# EAGLE design BL (EAGLE 6.6.0)
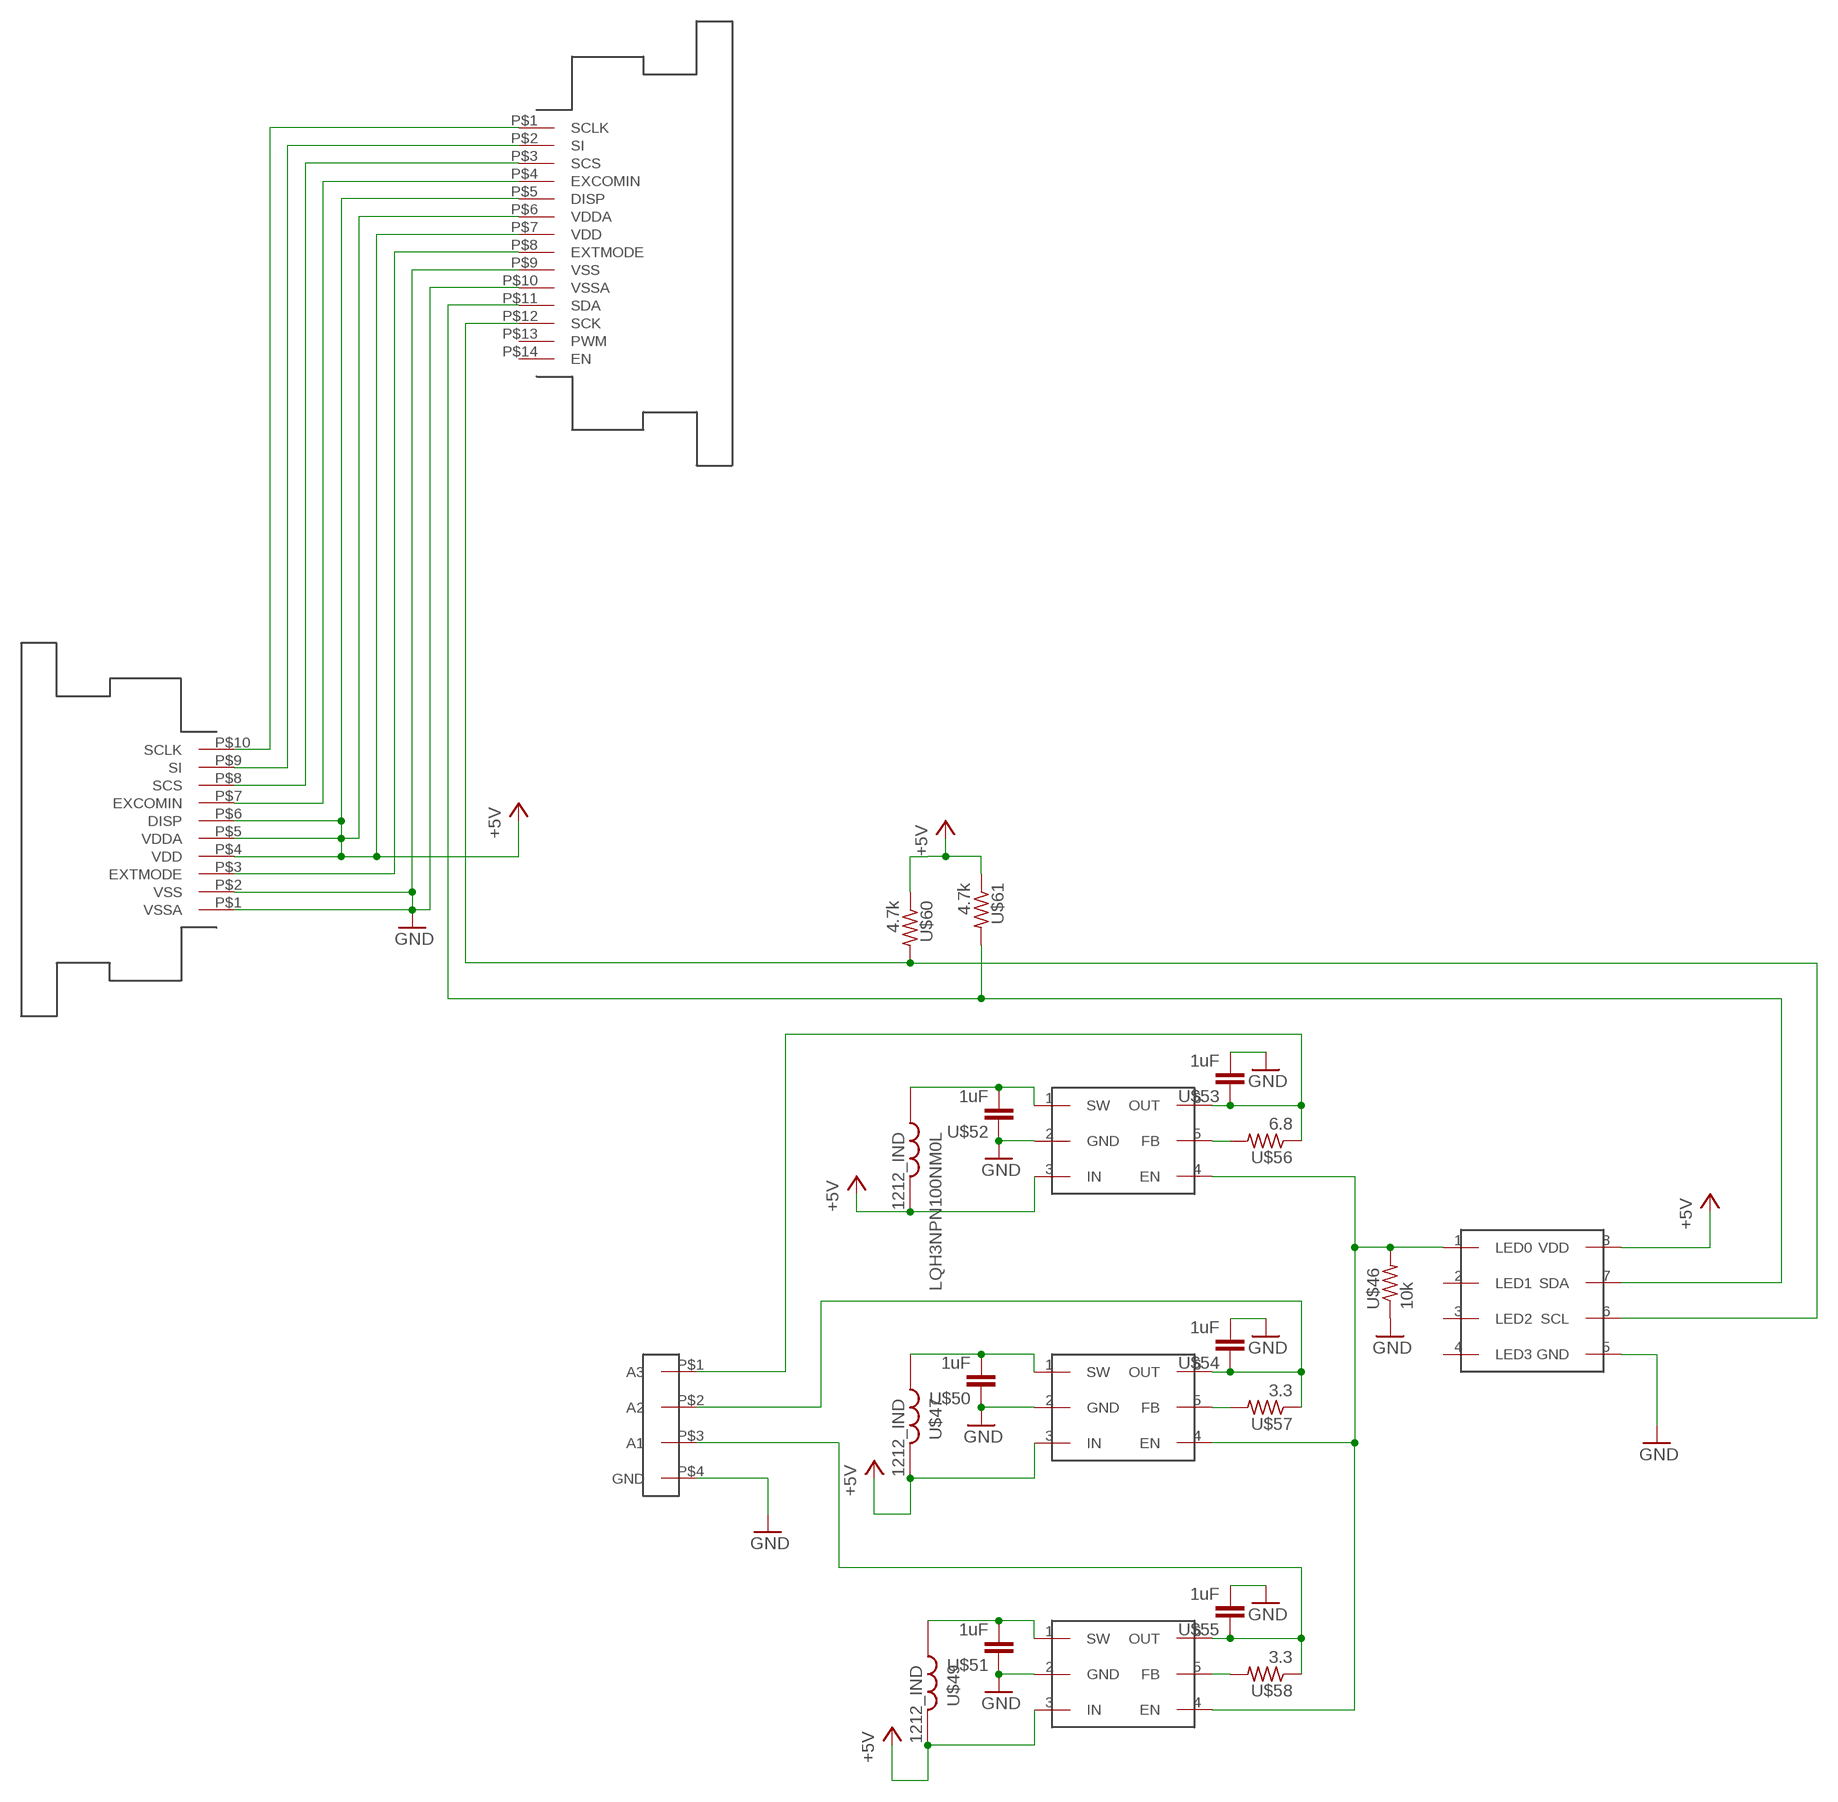
[diagram p0: schematic, sheet 1]

## Parts
LQH3NPN100NM0L  1212_IND  [1212_IND]
U$1  52745-1097  [52745-1097]
U$2  SFV14R-2STE1HLF  [SFV14R-2STE1HLF]
U$36  SC4541  [SOT23-6]
U$37  SC4541  [SOT23-6]
U$44  SC4541  [SOT23-6]
U$45  PCA9632DP1  [TSSOP-8]
U$46  10k  RF-R0805  [RF-C0805]
U$47  1212_IND  [1212_IND]
U$49  1212_IND  [1212_IND]
U$50  1uF  RF-C0805  [C0805]
U$51  1uF  RF-C0805  [C0805]
U$52  1uF  RF-C0805  [C0805]
U$53  1uF  RF-C0805  [C0805]
U$54  1uF  RF-C0805  [C0805]
U$55  1uF  RF-C0805  [C0805]
U$56  6.8  RF-R0805  [RF-C0805]
U$57  3.3  RF-R0805  [RF-C0805]
U$58  3.3  RF-R0805  [RF-C0805]
U$59  BL_CONSOLDER  [S9091-46R]
U$60  4.7k  RF-R0805  [RF-C0805]
U$61  4.7k  RF-R0805  [RF-C0805]

## Nets
+5V: LQH3NPN100NM0L.P$1 U$1.P$4(VDD) U$1.P$5(VDDA) U$1.P$6(DISP) U$2.P$5(DISP) U$2.P$6(VDDA) U$2.P$7(VDD) U$36.3(IN) U$37.3(IN) U$44.3(IN) U$45.8(VDD) U$47.P$1 U$49.P$1 U$60.1 U$61.1
GND [GND]: U$1.P$1(VSSA) U$1.P$2(VSS) U$2.P$9(VSS) U$2.P$10(VSSA) U$36.2(GND) U$37.2(GND) U$44.2(GND) U$45.5(GND) U$46.1 U$50.1 U$51.1 U$52.1 U$53.2 U$54.2 U$55.2 U$59.P$4(GND)
N$1: U$1.P$10(SCLK) U$2.P$1(SCLK)
N$2: U$1.P$9(SI) U$2.P$2(SI)
N$3: U$1.P$8(SCS) U$2.P$3(SCS)
N$4: U$1.P$7(EXCOMIN) U$2.P$4(EXCOMIN)
N$8: U$1.P$3(EXTMODE) U$2.P$8(EXTMODE)
N$43: U$36.4(EN) U$37.4(EN) U$44.4(EN) U$45.1(LED0) U$46.2
N$44: U$37.1(SW) U$47.P$2 U$50.2
N$45: U$2.P$11(SDA) U$45.7(SDA) U$61.2
N$46: LQH3NPN100NM0L.P$2 U$36.1(SW) U$52.2
N$47: U$2.P$12(SCK) U$45.6(SCL) U$60.2
N$48: U$44.1(SW) U$49.P$2 U$51.2
N$50: U$44.5(FB) U$58.2
N$51: U$44.6(OUT) U$55.1 U$58.1 U$59.P$3(A1)
N$52: U$37.5(FB) U$57.2
N$53: U$37.6(OUT) U$54.1 U$57.1 U$59.P$2(A2)
N$54: U$36.6(OUT) U$53.1 U$56.1 U$59.P$1(A3)
N$55: U$36.5(FB) U$56.2
Unconnected: U$2.P$13(PWM) U$2.P$14(EN) U$45.2(LED1) U$45.3(LED2) U$45.4(LED3)

## Library data of the parts
LQH3NPN100NM0L U$47 U$49 = KW2:1212_IND; MFGN: Murata; MFGP: LQH3NPN100NM0L
U$1 = KW2:52745-1097
U$2 = KW2:SFV14R-2STE1HLF
U$36 U$37 U$44 = KW2:SC4541; MFGN: Semtech; MFGP: SC4541
U$45 = KW2:PCA9632DP1; MFGN: NXP; MFGP: PCA9632DP1
U$46 = GW-devices:RF-R: RF resistor pads for FSL reference design; MFGN: Vishay Dale; MFGP: CRCW080510K0FKEA
U$50-U$55 = GW-devices:RF-C: RF capacitor pads for FSL reference design; MFGN: TDK; MFGP: C2012X5R1E105K125AA
U$56 = GW-devices:RF-R: RF resistor pads for FSL reference design; MFGN: Yageo; MFGP: RC0805FR-076R8L
U$57 U$58 = GW-devices:RF-R: RF resistor pads for FSL reference design; MFGN: Samsung; MFGP: RC2012F3R3CS
U$59 = KW2:BL_CON
U$60 U$61 = GW-devices:RF-R: RF resistor pads for FSL reference design; MFGN: Panasonic; MFGP: ERJ-6ENF4701V

## Board
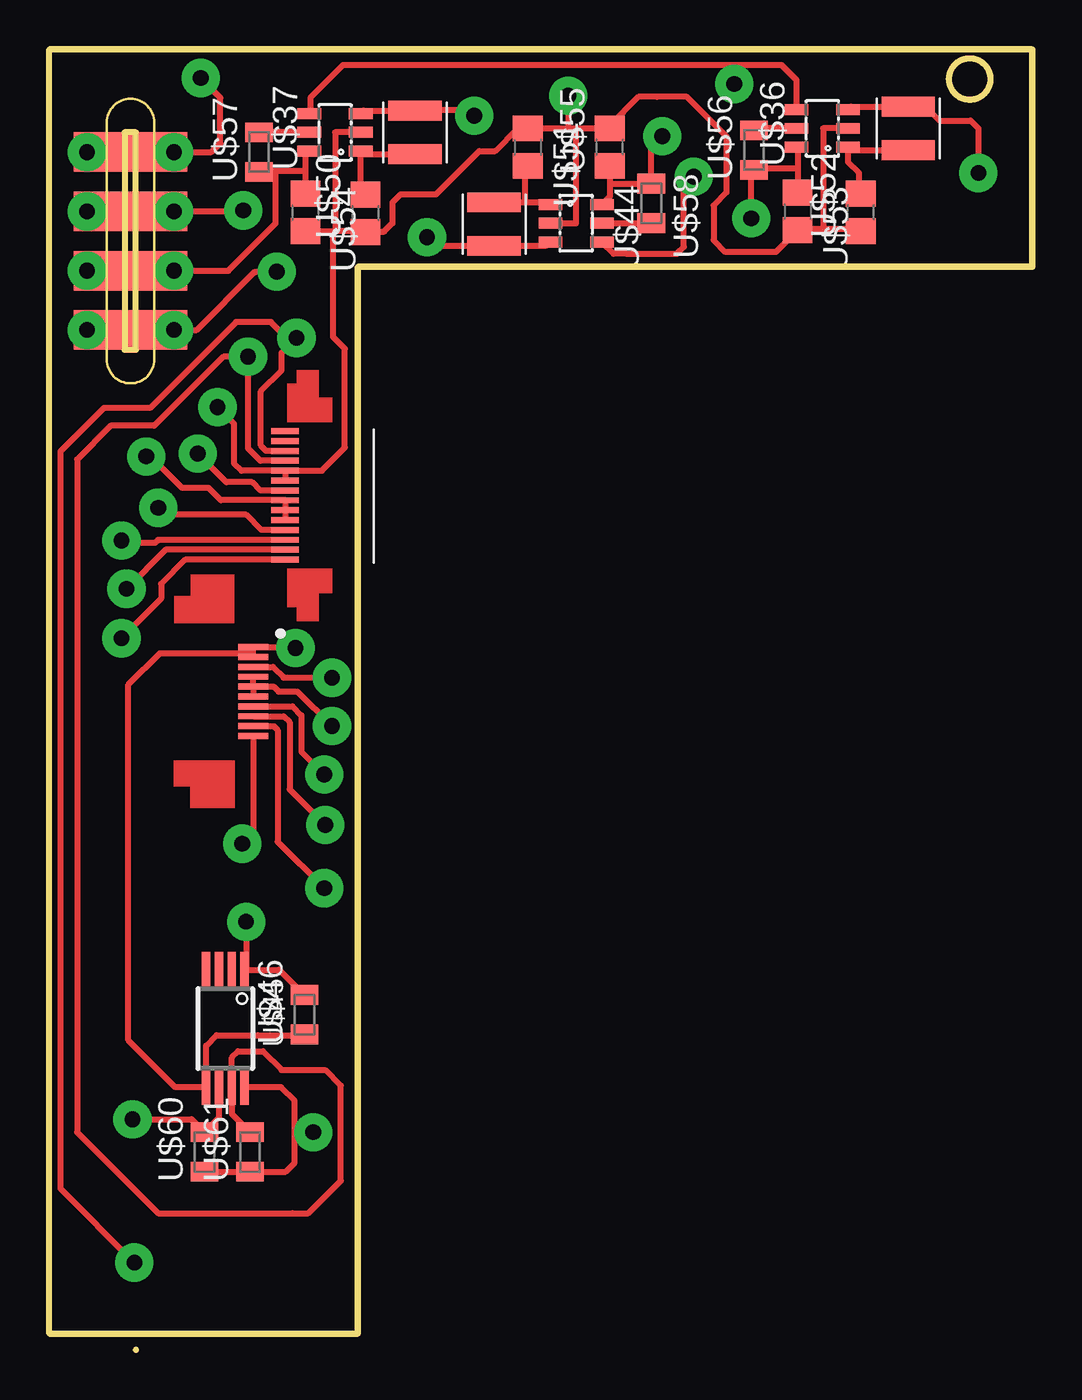
[diagram p1: board, top side]
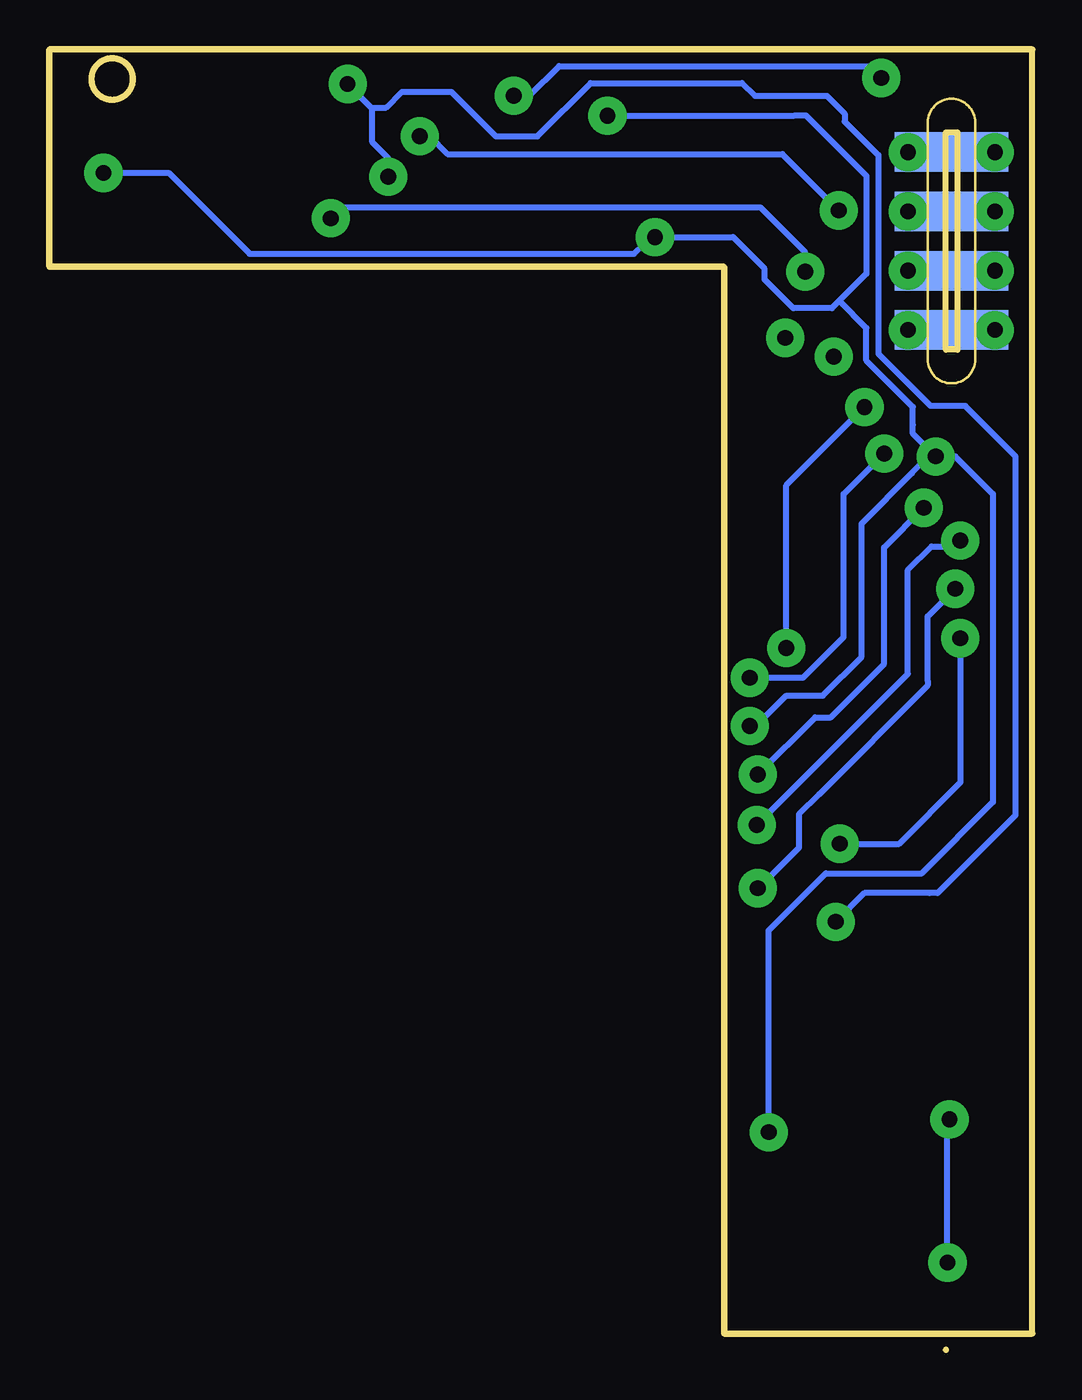
[diagram p2: board, bottom side, seen from below]

Size 49.74 x 65.83 mm. Coordinates in mm from the lower left corner, seen from the top.
Outline: 15.6,54.83 49.73,54.83
Outline: 49.73,54.83 15.6,54.83
Outline: 49.73,54.83 49.73,65.83
Outline: 49.73,65.83 49.73,54.83
Outline: 49.73,65.83 17.1,65.83 0,65.83
Outline: 0,65.83 49.73,65.83
Outline: 0,0.83 0,65.83
Outline: 0,0.83 15.6,0.83
Outline: 15.6,0.83 0,0.83
Outline: 15.6,0.83 15.6,54.83
Outline: 15.6,54.83 15.6,0.83
Outline: 4.38,0 4.38,0 4.38,0.03
Outline: 47.61,64.33 47.61,64.31 47.61,64.28 47.61,64.26 47.61,64.24 47.6,64.21 47.6,64.19 47.6,64.16 47.59,64.14 47.59,64.11 47.58,64.09 47.58,64.07 47.57,64.04 47.56,64.02 47.55,63.99 47.55,63.97 47.54,63.94 47.53,63.92 47.52,63.89 47.51,63.87 47.49,63.85 47.48,63.82 47.47,63.8 47.45,63.78 47.44,63.75 47.42,63.73 47.41,63.71 47.39,63.69 47.38,63.67 47.36,63.65 47.34,63.63 47.32,63.61 47.3,63.59 47.28,63.57 47.26,63.55 47.24,63.53 47.22,63.51 47.2,63.5 47.18,63.48 47.16,63.47 47.13,63.45 47.11,63.44 47.09,63.42 47.07,63.41 47.04,63.4 47.02,63.38 46.99,63.37 46.97,63.36 46.95,63.35 46.92,63.34 46.9,63.34 46.87,63.33 46.85,63.32 46.82,63.31 46.8,63.31 46.77,63.3 46.75,63.3 46.73,63.29 46.7,63.29 46.68,63.29 46.65,63.28 46.63,63.28 46.61,63.28 46.58,63.28 46.56,63.28 46.54,63.28 46.51,63.28 46.49,63.28 46.47,63.28 46.44,63.29 46.42,63.29 46.39,63.29 46.37,63.3 46.34,63.3 46.32,63.31 46.3,63.31 46.27,63.32 46.25,63.33 46.22,63.34 46.2,63.34 46.17,63.35 46.15,63.36 46.12,63.37 46.1,63.38 46.08,63.4 46.05,63.41 46.03,63.42 46.01,63.44 45.98,63.45 45.96,63.47 45.94,63.48 45.92,63.5 45.9,63.51 45.88,63.53 45.86,63.55 45.84,63.57 45.82,63.59 45.8,63.61 45.78,63.63 45.76,63.65 45.74,63.67 45.73,63.69 45.71,63.71 45.7,63.73 45.68,63.75 45.67,63.78 45.65,63.8 45.64,63.82 45.63,63.85 45.62,63.87 45.6,63.89 45.59,63.92 45.58,63.94 45.57,63.97 45.57,63.99 45.56,64.02 45.55,64.04 45.54,64.07 45.54,64.09 45.53,64.11 45.53,64.14 45.52,64.16 45.52,64.19 45.52,64.21 45.51,64.24 45.51,64.26 45.51,64.28 45.51,64.31 45.51,64.33 45.51,64.35 45.51,64.38 45.51,64.4 45.51,64.42 45.52,64.45 45.52,64.47 45.52,64.5 45.53,64.52 45.53,64.54 45.54,64.57 45.54,64.59 45.55,64.62 45.56,64.64 45.57,64.67 45.57,64.69 45.58,64.72 45.59,64.74 45.6,64.76 45.62,64.79 45.63,64.81 45.64,64.84 45.65,64.86 45.67,64.88 45.68,64.9 45.7,64.93 45.71,64.95 45.73,64.97 45.74,64.99 45.76,65.01 45.78,65.03 45.8,65.05 45.82,65.07 45.84,65.09 45.86,65.11 45.88,65.13 45.9,65.14 45.92,65.16 45.94,65.18 45.96,65.19 45.98,65.21 46.01,65.22 46.03,65.24 46.05,65.25 46.08,65.26 46.1,65.27 46.12,65.29 46.15,65.3 46.17,65.31 46.2,65.32 46.22,65.32 46.25,65.33 46.27,65.34 46.3,65.35 46.32,65.35 46.34,65.36 46.37,65.36 46.39,65.37 46.42,65.37 46.44,65.37 46.47,65.38 46.49,65.38 46.51,65.38 46.54,65.38 46.56,65.38 46.58,65.38 46.61,65.38 46.63,65.38 46.65,65.38 46.68,65.37 46.7,65.37 46.73,65.37 46.75,65.36 46.77,65.36 46.8,65.35 46.82,65.35 46.85,65.34 46.87,65.33 46.9,65.32 46.92,65.32 46.95,65.31 46.97,65.3 46.99,65.29 47.02,65.27 47.04,65.26 47.07,65.25 47.09,65.24 47.11,65.22 47.13,65.21 47.16,65.19 47.18,65.18 47.2,65.16 47.22,65.14 47.24,65.13 47.26,65.11 47.28,65.09 47.3,65.07 47.32,65.05 47.34,65.03 47.36,65.01 47.38,64.99 47.39,64.97 47.41,64.95 47.42,64.93 47.44,64.9 47.45,64.88 47.47,64.86 47.48,64.84 47.49,64.81 47.51,64.79 47.52,64.76 47.53,64.74 47.54,64.72 47.55,64.69 47.55,64.67 47.56,64.64 47.57,64.62 47.58,64.59 47.58,64.57 47.59,64.54 47.59,64.52 47.6,64.5 47.6,64.47 47.6,64.45 47.61,64.42 47.61,64.4 47.61,64.38 47.61,64.35 47.61,64.33
Outline: 3.8,50.63 4.38,50.63 4.38,61.63 3.8,61.63 3.8,50.63
Copper layers (1*16): Top 0.035mm / dielectric 1.5mm / Bottom 0.035mm
Design rules "default *": minimum track width 10mil, minimum drill 24mil, track to track 0.25mm, track to pad 0.25mm, pad to pad 0.25mm, via to via 0.25mm, smd to smd 0.25mm, copper to edge 40mil, drill to drill 8mil, minimum pad ring 10mil, minimum via ring 8mil, stop-mask expansion 4mil, vias tented up to drill 0mil, thermal gap 10mil

### Footprints (pad centres in the part's own frame; a part is rotated, then mirrored left to right if it is on the bottom)
1212_IND = smd 1 x 2.7: P$1 -1.1,0; P$2 1.1,0
52745-1097 = smd 0.3 x 1.5: P$1 -2.25,0.95; P$2 -1.75,0.95; P$3 -1.25,0.95; P$4 -0.75,0.95; P$5 -0.25,0.95; P$6 0.25,0.95; P$7 0.75,0.95; P$8 1.25,0.95; P$9 1.75,0.95; P$10 2.25,0.95
SFV14R-2STE1HLF = smd 0.3 x 1.4: P$1 -3.25,0; P$2 -2.75,0; P$3 -2.25,0; P$4 -1.75,0; P$5 -1.25,0; P$6 -0.75,0; P$7 -0.25,0; P$8 0.25,0; P$9 0.75,0; P$10 1.25,0; P$11 1.75,0; P$12 2.25,0; P$13 2.75,0; P$14 3.25,0
SOT23-6 = smd 0.55 x 1.2: 1 -0.95,-1.3; 2 0,-1.3; 3 0.95,-1.3; 4 0.95,1.3; 5 0,1.3; 6 -0.95,1.3
TSSOP-8 = smd 0.42 x 1.78: 1 -0.975,-2.975; 2 -0.325,-2.975; 3 0.325,-2.975; 4 0.975,-2.975; 5 0.975,2.975; 6 0.325,2.975; 7 -0.325,2.975; 8 -0.975,2.975
RF-C0805 = smd 1 x 1.4: 1 -1,0; 2 1,0
C0805 = smd 1.3 x 1.5: 1 -0.95,0; 2 0.95,0
S9091-46R = smd 2 x 5.75: P$1 -4.5,0; P$2 -1.5,0; P$3 1.5,0; P$4 4.5,0 | smd 2 x 5.75 bottom: P$5 4.5,0; P$6 1.5,0; P$7 -1.5,0; P$8 -4.5,0 | drill 0.8 pad 1.93: P$9 -4.5,2.2; P$10 -1.5,2.2; P$11 1.5,2.2; P$12 4.5,2.2; P$13 -4.5,-2.2; P$14 -1.5,-2.2; P$15 1.5,-2.2; P$16 4.5,-2.2

### Placement (x,y rotation side)
LQH3NPN100NM0L  43.45,61.83 270 top
U$1  9.36,33.33 270 top
U$2  11.92,43.26 90 top
U$36  39.1,61.83 90 top
U$37  14.45,61.63 90 top
U$44  26.65,57.03 270 top
U$45  8.9,16.28 180 top
U$46  12.9,16.98 90 top
U$47  18.5,61.63 270 top
U$49  22.5,56.98 90 top
U$50  16,57.53 90 top
U$51  24.2,60.88 270 top
U$52  41.05,57.58 90 top
U$53  37.85,57.63 270 top
U$54  12.95,57.58 270 top
U$55  28.35,60.88 90 top
U$56  35.65,60.73 90 top
U$57  10.6,60.63 90 top
U$58  30.45,58.03 270 top
U$59  4.1,56.13 90 top
U$60  7.85,10.03 90 top
U$61  10.15,10.03 90 top

### Tracks (layer width: path | path; a pad name or v marks a point on that pad's centre or on a via)
+5V  (via drill 0.8 pad 1.93)
  Top 0.305: U$36.3 40.55,62.93 LQH3NPN100NM0L.P$1 44.35,62.93 45.05,62.23 46.6,62.23 47,61.83 v47,59.58 | U$37.3 15.9,62.73 U$47.P$1 18.55,62.78 20.9,62.78 21.2,62.78 v21.5,62.48 | U$2.P$5 U$2.P$6 U$2.P$7 8.67,43.01 8.05,43.63 6.73,43.63 6.42,43.93 5.13,45.23 v4.9,45.23 | U$1.P$5 U$1.P$4 | U$1.P$5 U$1.P$6 | U$1.P$5 11.35,33.58 11.6,33.33 12.55,33.33 v14.3,31.58 | U$60.1 U$61.1 11.95,9.03 12.4,9.48 12.4,11.03 | 12.4,11.03 12.4,12.63 11.75,13.28 11.72,13.3 U$45.8 | 12.4,11.03 v13.35,11.03 | v19.1,56.33 19.55,55.88 U$49.P$1 25.1,55.88 25.25,56.03 25.3,56.03 U$44.3
  Bottom 0.305: v47,59.58 43.7,59.58 39.6,55.48 20.15,55.48 19.68,55.95 19.5,56.13 | 19.5,56.13 19.3,56.33 | 19.3,56.33 v19.1,56.33 | v19.1,56.33 15.15,56.33 13.55,54.73 13.55,54.18 12.1,52.73 10.15,52.73 9.78,53.1 | v19.1,56.33 19.3,56.33 | 19.3,56.33 19.5,56.13 | v21.5,62.48 12.05,62.48 11.45,62.48 8.4,59.43 8.4,54.48 9.78,53.1 | v14.3,31.58 14,31.58 12.45,33.13 10.6,33.13 8.65,35.08 8.65,40.48 8.65,41.83 6.1,44.38 5.25,45.23 v4.9,45.23 | v13.35,11.03 13.35,21.23 10.45,24.13 5.6,24.13 2,27.73 2,43.33 3.9,45.23 v4.9,45.23 | v4.9,45.23 6.05,46.38 6.05,46.83 6.05,47.73 8.4,50.08 8.4,51.73 9.78,53.1
GND  (via drill 0.8 pad 1.93)
  Top 0.305: U$36.2 39.15,61.83 39.15,56.73 | 39.15,56.73 37.85,56.73 U$53.2 36.75,55.58 35.9,55.58 34.2,55.58 33.6,56.18 33.6,57.93 34.25,58.58 34.25,60.23 34.25,61.43 32.25,63.43 30.75,63.43 29.8,63.43 28.35,61.98 U$55.2 26.65,61.83 | U$52.1 40.95,56.73 39.15,56.73 | U$37.2 14.45,61.63 14.45,56.63 | U$54.2 14.45,56.63 | 14.45,56.63 15.95,56.63 U$50.1 16.9,56.58 16.95,56.63 17.35,57.03 17.35,58.08 17.75,58.48 19.55,58.48 21.75,60.68 22.55,60.68 23.7,61.83 U$51.1 26.3,61.83 | U$2.P$10 U$2.P$9 | U$2.P$10 13.78,44.51 14.95,45.68 14.95,50.68 14.35,51.28 14.35,56.53 14.45,56.63 | U$59.P$4 8.2,60.63 8.65,61.08 8.65,63.38 v7.65,64.38 | U$2.P$10 9.72,44.51 9.35,44.88 9.35,46.88 v8.5,47.73 | U$44.2 26.65,57.03 26.65,61.58 26.65,61.83 | 26.3,61.83 26.65,61.83 | v26.25,63.48 26.25,61.83 26.3,61.83 | v12.45,35.53 12.4,35.58 11.95,35.58 U$1.P$1 U$1.P$2 10.11,35.28 5.6,35.28 4,33.68 4,15.68 6.38,13.3 U$45.5 7.92,15.4 8.45,15.93 10.55,15.93 11.15,15.93 12.5,15.93 12.85,15.93 U$46.1
  Bottom 0.305: v26.25,63.48 25.45,63.48 23.95,64.98 8.25,64.98 v7.65,64.38 | v12.45,35.53 12.45,43.78 v8.5,47.73
N$1  (via drill 0.8 pad 1.93)
  Top 0.305: U$1.P$10 10.31,26.19 v9.75,25.63 | U$2.P$1 6.88,40.01 5.65,38.78 5.65,38.03 v3.65,36.03
  Bottom 0.305: v9.75,25.63 6.75,25.63 3.65,28.73 v3.65,36.03
N$2  (via drill 0.8 pad 1.93)
  Top 0.305: v13.9,23.38 11.55,25.73 11.55,31.38 11.35,31.58 U$1.P$9 | U$2.P$2 5.88,40.51 v3.9,38.53
  Bottom 0.305: v13.9,23.38 13.85,23.38 11.8,25.43 11.8,27.13 10.8,28.13 5.3,33.63 5.3,33.88 5.3,37.13 v3.9,38.53
N$3  (via drill 0.8 pad 1.93)
  Top 0.305: U$1.P$8 11.85,32.08 12.15,31.78 12.15,28.38 v13.95,26.58 | U$2.P$3 5.49,41.01 5.34,40.85 3.78,40.85 v3.65,40.98
  Bottom 0.305: v3.65,40.98 3.95,40.68 5.1,40.68 6.3,39.48 6.3,34.23 v13.95,26.58
N$4  (via drill 0.8 pad 1.93)
  Top 0.305: U$1.P$7 12.3,32.58 12.75,32.13 12.75,30.28 v13.9,29.13 | U$2.P$4 10.72,41.51 9.95,42.28 5.85,42.28 v5.5,42.63
  Bottom 0.305: v13.9,29.13 11,32.03 10.2,32.03 7.5,34.73 7.5,40.63 v5.5,42.63
N$8  (via drill 0.8 pad 1.93)
  Top 0.305: U$1.P$3 11.3,34.58 11.85,34.03 12.55,34.03 v14.3,34.03 | U$2.P$8 10.67,43.51 10.25,43.93 8.95,43.93 v7.5,45.38
  Bottom 0.305: v14.3,34.03 11.6,34.03 9.55,36.08 9.55,40.63 9.55,41.59 9.55,43.33 v7.5,45.38
N$43  (via drill 0.8 pad 1.93)
  Top 0.305: U$36.4 37.8,64.28 37.05,65.03 34.55,65.03 | 34.55,65.03 14.85,65.03 13.2,63.38 13.2,62.63 U$37.4 | v32.6,59.38 32.1,58.88 32.1,55.83 31.75,55.48 29.2,55.48 28.55,55.48 U$44.4 | v34.65,64.08 34.65,64.93 34.55,65.03 | v9.95,21.68 9.95,19.33 U$45.1 11.62,19.25 U$46.2
  Bottom 0.305: v32.6,59.38 32.6,60.33 33.4,61.13 33.4,62.83 33.45,62.88 | 33.45,62.88 v34.65,64.08 | 33.45,62.88 32.7,62.88 31.9,63.68 29.4,63.68 27.15,61.43 25.05,61.43 22.35,64.13 14.7,64.13 14.05,63.48 10.4,63.48 9.5,62.58 9.5,62.18 7.8,60.48 7.8,51.13 7.8,50.43 7.65,50.28 5.15,47.78 3.4,47.78 2.8,47.18 0.85,45.23 0.85,27.08 4.8,23.13 5.2,23.13 8.5,23.13 v9.95,21.68
N$44
  Top 0.305: U$47.P$2 15.9,60.53 U$37.1 15.75,58.73 U$50.2
N$45  (via drill 0.8 pad 1.93)
  Top 0.305: U$61.2 9.22,11.95 U$45.7 9.22,14.8 9.55,15.13 10.8,15.13 11.75,14.18 13.95,14.18 14.75,13.38 14.75,8.58 13.1,6.93 12.3,6.93 5.5,6.93 1.4,11.03 1.4,45.08 3.1,46.78 5.3,46.78 6.1,47.58 8.8,50.28 v10.05,50.28 10.05,45.63 10.67,45.01 U$2.P$11
N$46
  Top 0.305: LQH3NPN100NM0L.P$2 40.55,60.73 U$36.1 40.4,60.13 40.95,59.58 40.95,58.63 U$52.2
N$47  (via drill 0.8 pad 1.93)
  Top 0.305: U$45.6 8.57,11.75 U$60.2 7.2,11.68 v4.2,11.68 | v4.3,4.43 0.55,8.18 0.55,45.48 2.75,47.68 5.1,47.68 9.45,52.03 11.2,52.03 11.85,51.38 12,51.23 v12.5,51.23 11.75,50.48 11.75,49.58 10.7,48.53 10.7,45.78 10.97,45.51 U$2.P$12
  Bottom 0.305: v4.3,4.43 4.3,11.58 v4.2,11.68
N$48
  Top 0.305: 24.05,58.08 24.35,58.08 25.15,58.08 25.25,57.98 U$44.1 | 24.05,58.08 U$49.P$2 | U$51.2 24.05,59.78 24.05,58.08
N$50
  Top 0.305: U$44.5 U$58.2
N$51  (via drill 0.8 pad 1.93)
  Top 0.305: U$44.6 28.35,58.38 U$55.1 28.35,59.03 U$58.1 30.45,60.88 v31,61.43 | U$59.P$3 9.75,57.63 v9.8,57.68
  Bottom 0.305: v31,61.43 30.5,61.43 29.6,60.53 12.65,60.53 v9.8,57.68
N$52
  Top 0.305: U$37.5 U$57.2
N$53
  Top 0.305: U$37.6 12.95,60.48 12.95,59.68 | 12.95,59.68 U$54.1 | 11.3,59.68 10.65,59.68 U$57.1 10.65,59.63 10.7,59.68 11.3,59.68 | 11.3,59.68 11.45,59.68 | 11.45,59.68 12.95,59.68 | U$59.P$2 9.05,54.63 11.45,57.03 11.45,59.68
N$54  (via drill 0.8 pad 1.93)
  Top 0.305: U$36.6 37.85,60.83 37.85,59.83 | 37.85,59.83 U$53.1 | 35.3,59.83 35.7,59.83 | 35.7,59.83 37.85,59.83 | v35.5,57.28 35.5,59.58 U$56.1 35.65,59.78 35.7,59.83 | U$59.P$1 7.45,51.63 10.35,54.53 10.4,54.58 v11.5,54.58
  Bottom 0.305: v35.5,57.28 34.95,57.83 34.7,57.83 33.45,57.83 13.75,57.83 11.5,55.58 v11.5,54.58
N$55
  Top 0.305: U$36.5 35.6,61.83 | 35.6,61.83 35.3,61.83 | U$56.2 35.65,61.78 35.6,61.83